# EAGLE board imix (EAGLE 7.5.0), part 1 of 2
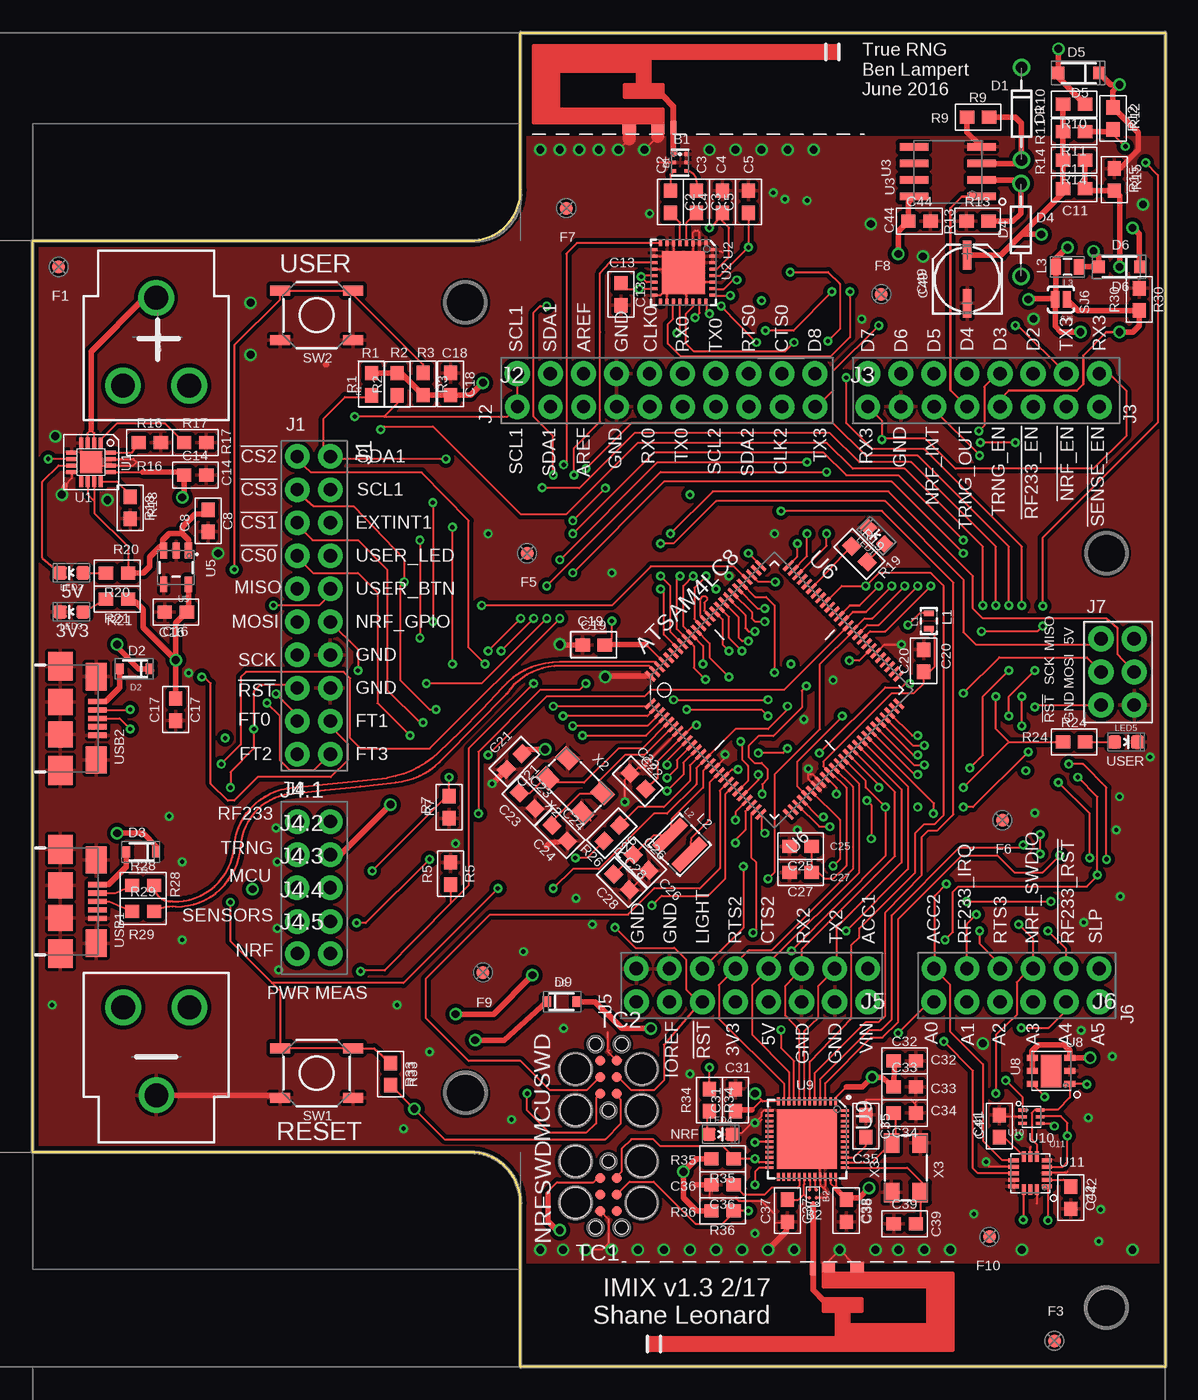
[diagram p8: board, top side]
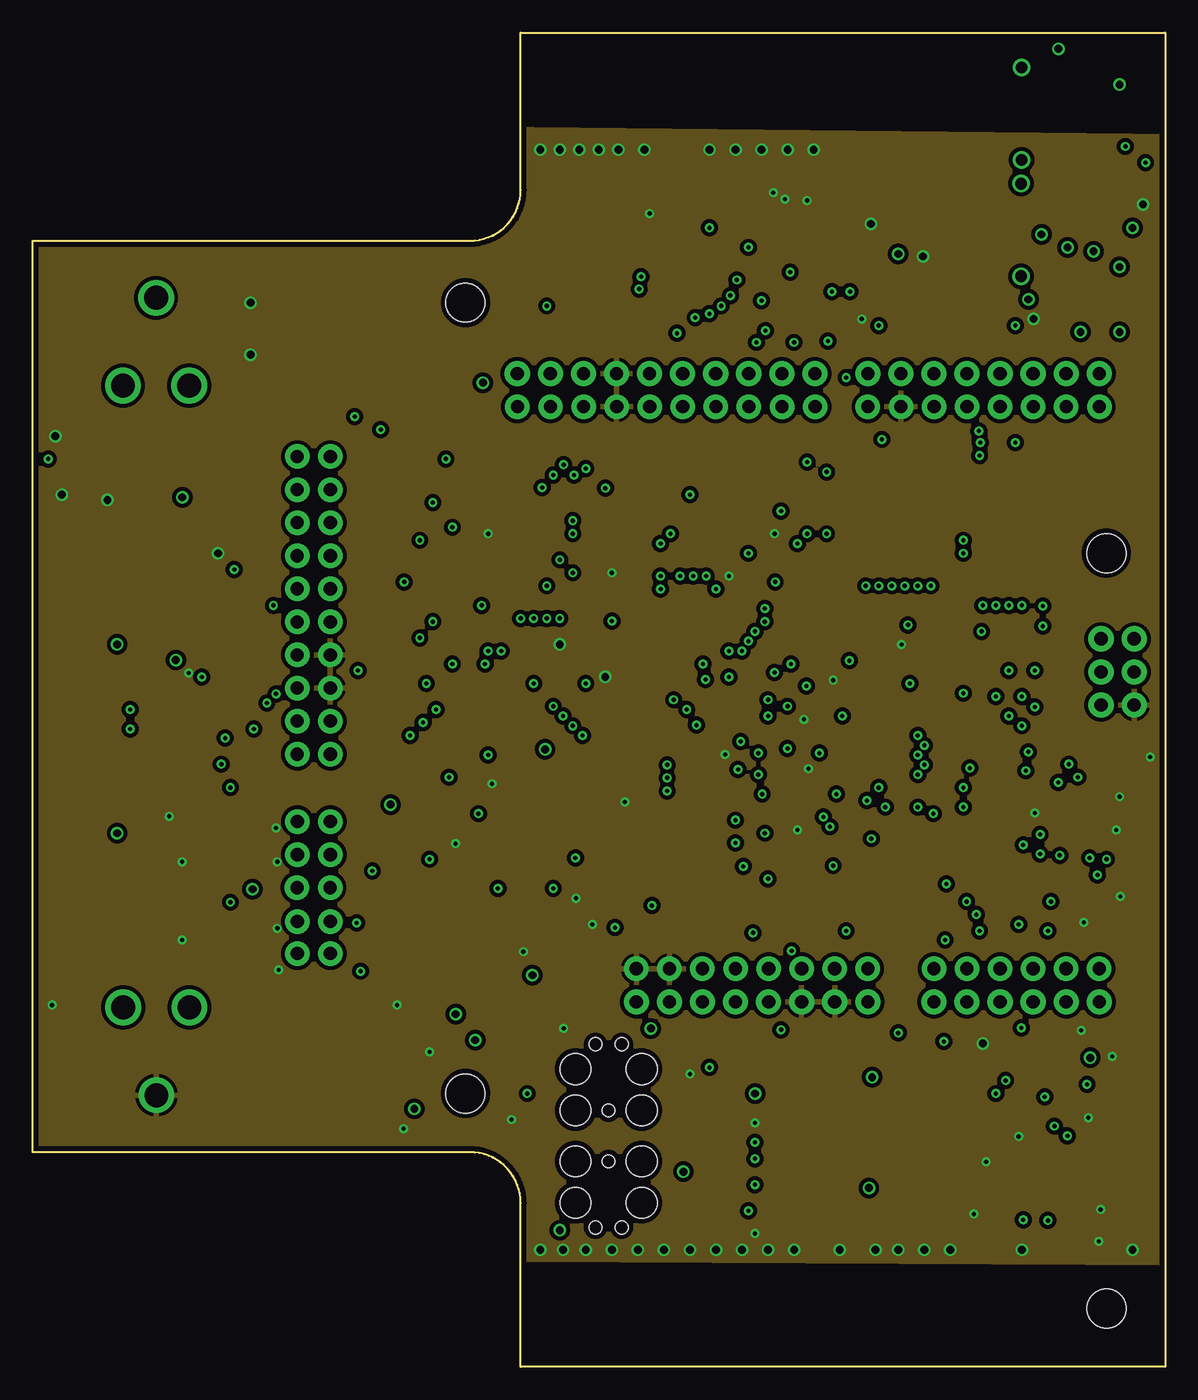
[diagram p9: board, inner layer Route2]
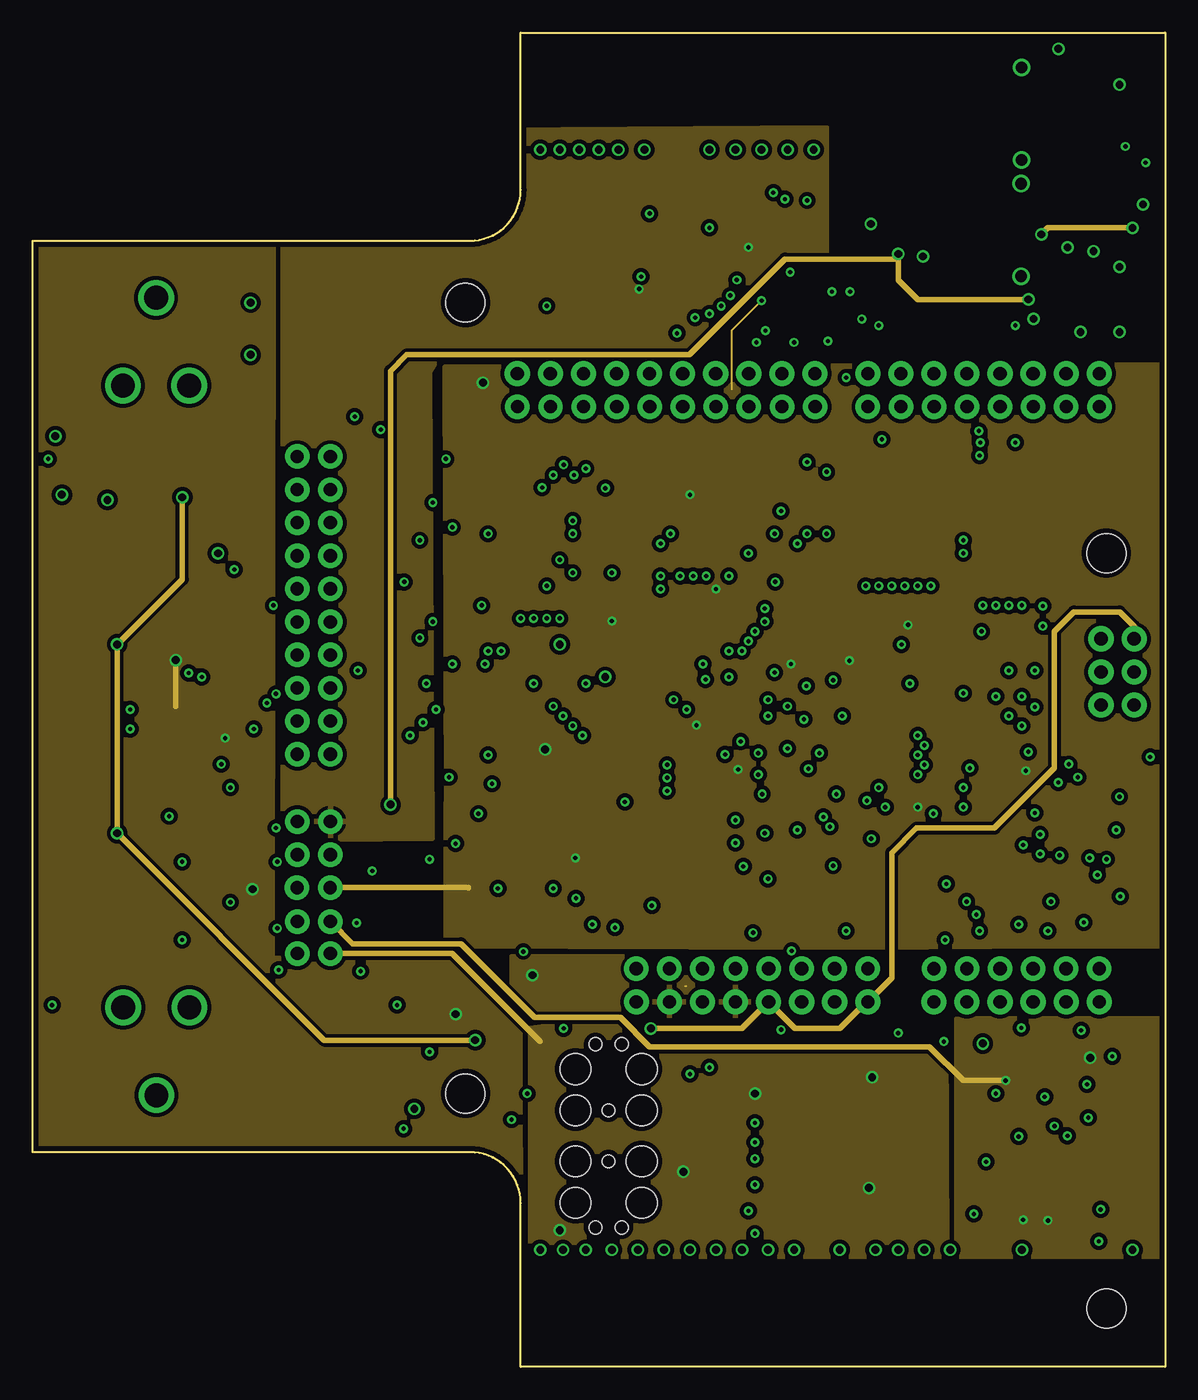
[diagram p10: board, inner layer Route15]
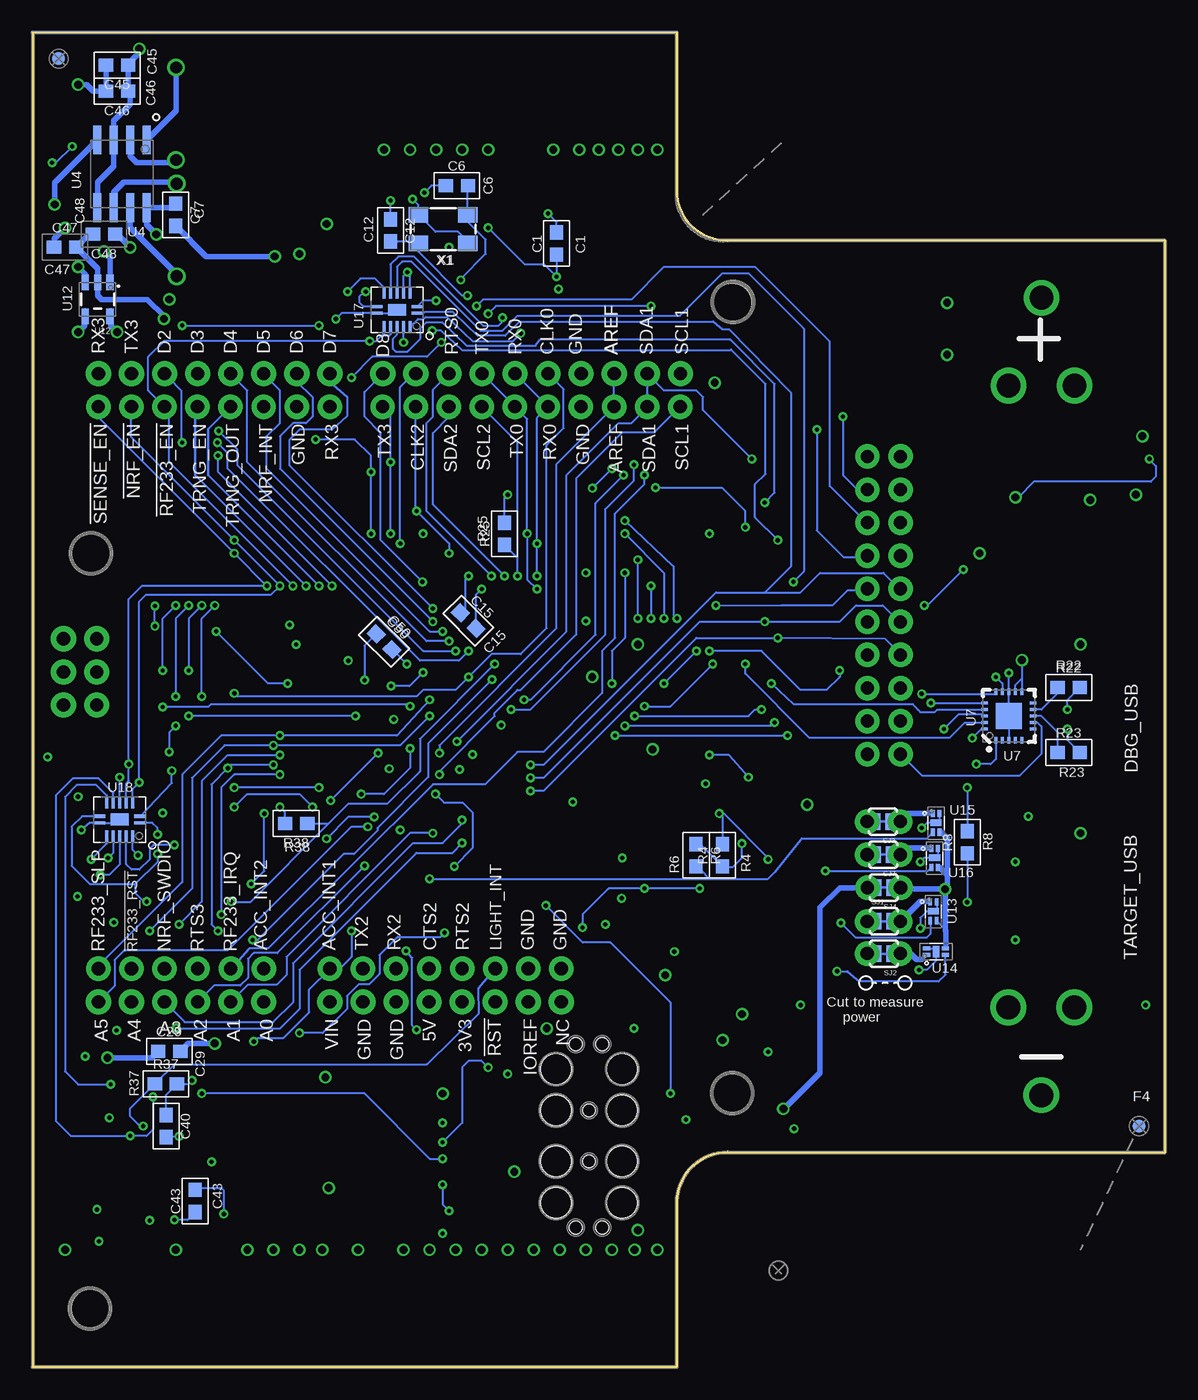
[diagram p11: board, bottom side, seen from below]

Size 87 x 102.5 mm. Coordinates in mm from the lower left corner, seen from the top.
Outline: 0,16.5 0,86.5 33.59,86.5 arc90 37.5,90.41 37.5,102.5 87,102.5 87,0 37.5,0 37.5,12.6 arc90 33.59,16.5 0,16.5
Copper layers (1+2*15+16): Top 0.0356mm / dielectric 9mil / Route2 0.0356mm / dielectric 40mil / Route15 0.0356mm / dielectric 9mil / Bottom 0.0356mm
Design rules "oshpark-2layer *": minimum track width 6mil, minimum drill 13mil, track to track 6mil, track to pad 6mil, pad to pad 6mil, via to via 6mil, smd to smd 6mil, copper to edge 15mil, drill to drill 6mil, minimum pad ring 7mil, minimum via ring 7mil, stop-mask expansion 2.5mil, vias tented up to drill 13mil, thermal gap 10mil
Net classes: 0 default: width 0.152 mm, drill 0.33 mm, clearance 0.152 mm; 1 power: width 0.152 mm, drill 0.33 mm, clearance 0.254 mm; 2 50ohm: width 0.152 mm, drill 0.33 mm, clearance 0.254 mm
Holes 3 mm at 33.25,81.75 33.25,21 82.5,4.5 82.5,62.5

## Footprints (pad centres in the part's own frame; a part is rotated, then mirrored left to right if it is on the bottom)
BALUN0805 = smd 0.3 x 0.3: 1 1.65,1.1; 2 1,1.1; 3 0.35,1.1; 4 0.35,0.15; 5 1,0.15; 6 1.65,0.15
BAL_NRF01D3 = smd 0.264 x 0.264: DIFF@1 0.219,0.25; DIFF@2 0.219,0.75; GND 0.819,0.75; SE 1.252,0.5; VCC 0.819,0.25
BATTERY_18650-HOLDER = drill 1.829: GND@1 30.628,0.01; GND@2 23.88,2.55; GND@3 23.88,-2.53; PWR@1 -30.628,-0.01; PWR@2 -23.88,2.53; PWR@3 -23.88,-2.55
C0603 = smd 1.1 x 1: 1 -0.85,0; 2 0.85,0
C0603-NOSILK = smd 1.1 x 1: 1 -0.85,0; 2 0.85,0
PANASONIC_C = smd 2.2 x 0.65: + 1.9,-0.2; - -1.8,-0.2
DIODE-ZENER = drill 0.9: P$1 -3.556,0; P$2 3.556,0
SOD-323 = smd 0.63 x 0.83: A 1.15,0; C -1.15,0
SOD-123 = smd 0.9 x 0.95: A 1.575,0; C -1.575,0
FIDUCIAL = smd 1 x 1: P$1 0,0
2X10_ROUND_NOSILK = drill 1.016 pad 1.88: 1 -11.43,-1.27; 2 -11.43,1.27; 3 -8.89,-1.27; 4 -8.89,1.27; 5 -6.35,-1.27; 6 -6.35,1.27; 7 -3.81,-1.27; 8 -3.81,1.27; 9 -1.27,-1.27; 10 -1.27,1.27; 11 1.27,-1.27; 12 1.27,1.27; 13 3.81,-1.27; 14 3.81,1.27; 15 6.35,-1.27; 16 6.35,1.27; 17 8.89,-1.27; 18 8.89,1.27; 19 11.43,-1.27; 20 11.43,1.27
1X10_NO_SILK = drill 1.016 pad 1.88: 1 0,0; 2 2.54,0; 3 5.08,0; 4 7.62,0; 5 10.16,0; 6 12.7,0; 7 15.24,0; 8 17.78,0; 9 20.32,0; 10 22.86,0
ARDUINO_R3_NO_HOLES = drill 1.016 pad 1.93: 3.3V 35.56,2.54; 5V 38.1,2.54; A0 50.8,2.54; A1 53.34,2.54; A2 55.88,2.54; A3 58.42,2.54; A4 60.96,2.54; A5 63.5,2.54; AREF 23.876,50.8; D0 63.5,50.8; D1 60.96,50.8; D2 58.42,50.8; D3 55.88,50.8; D4 53.34,50.8; D5 50.8,50.8; D6 48.26,50.8; D7 45.72,50.8; D8 41.656,50.8; D9 39.116,50.8; D10 36.576,50.8; D11 34.036,50.8; D12 31.496,50.8; D13 28.956,50.8; GND@1 40.64,2.54; GND@2 43.18,2.54; GND@3 26.416,50.8; GND@4 66.18,25.35; IOREF 30.48,2.54; MISO 63.64,30.43; MOSI 66.18,27.89; NC 27.94,2.54; RESET@1 33.02,2.54; RESET@2 63.64,25.35; SCK 63.64,27.89; SCL 18.796,50.8; SDA 21.336,50.8; VCC 66.18,30.43; VIN 45.72,2.54
1X08_NO_SILK = drill 1.016 pad 1.88: 1 0,0; 2 2.54,0; 3 5.08,0; 4 7.62,0; 5 10.16,0; 6 12.7,0; 7 15.24,0; 8 17.78,0
1X02_NO_SILK = drill 1.016 pad 1.88: 1 0,0; 2 2.54,0
1X06_NO_SILK = drill 1.016 pad 1.88: 1 0,0; 2 2.54,0; 3 5.08,0; 4 7.62,0; 5 10.16,0; 6 12.7,0
L0603 = smd 0.4 x 0.8: 1 0.2,0.4; 2 1.4,0.4
L1212 = smd 0.9 x 3: 1 -1.05,0; 2 1.05,0
0805 = smd 0.8 x 1.2: 1 -0.9,0; 2 0.9,0
LED-0603 = smd 1 x 1: A 0,-0.877; C 0,0.877
0603-RES = smd 1.1 x 1: 1 -0.85,0; 2 0.85,0
PAD-JUMPER-2-NC_BY_TRACE_YES_SILK = smd 0.635 x 1.27: 1 -0.508,0; 2 0.508,0
SJ_2S-NO = smd 0.635 x 1.27: 1 -0.45,0; 2 0.45,0
TACTILE-SWITCH-SMD = smd 1.524 x 0.762: 1 -2.794,1.905; 2 2.794,1.905; 3 -2.794,-1.905; 4 2.794,-1.905
TC2030-IDC = smd 0.787 x 0.787: 1 -1.27,-0.635; 2 -1.27,0.635; 3 0,-0.635; 4 0,0.635; 5 1.27,-0.635; 6 1.27,0.635 | hole 0.991: -2.54,0; 2.54,1.016; 2.54,-1.016 | hole 2.375: -2.54,2.54; -2.54,-2.54; 0.635,2.54; 0.635,-2.54
QFP16_3X3 = smd 0.85 x 0.3: 1 -1.475,0.75; 2 -1.475,0.25; 3 -1.475,-0.25; 4 -1.475,-0.75; 9 1.475,-0.75; 10 1.475,-0.25; 11 1.475,0.25; 12 1.475,0.75 | smd 0.3 x 0.85: 5 -0.75,-1.475; 6 -0.25,-1.475; 7 0.25,-1.475; 8 0.75,-1.475; 13 0.75,1.475; 14 0.25,1.475; 15 -0.25,1.475; 16 -0.75,1.475 | smd 1.7 x 1.7: PAD 0,0
32QN2 = smd 0.5 x 0.23: 1 -2.25,1.75; 2 -2.25,1.25; 3 -2.25,0.75; 4 -2.25,0.25; 5 -2.25,-0.25; 6 -2.25,-0.75; 7 -2.25,-1.25; 8 -2.25,-1.75; 17 2.25,-1.75; 18 2.25,-1.25; 19 2.25,-0.75; 20 2.25,-0.25; 21 2.25,0.25; 22 2.25,0.75; 23 2.25,1.25; 24 2.25,1.75 | smd 0.23 x 0.5: 9 -1.75,-2.25; 10 -1.25,-2.25; 11 -0.75,-2.25; 12 -0.25,-2.25; 13 0.25,-2.25; 14 0.75,-2.25; 15 1.25,-2.25; 16 1.75,-2.25; 25 1.75,2.25; 26 1.25,2.25; 27 0.75,2.25; 28 0.25,2.25; 29 -0.25,2.25; 30 -0.75,2.25; 31 -1.25,2.25; 32 -1.75,2.25 | smd 3.3 x 3.3: PADDLE 0,0
SO8 = smd 0.6 x 2.2: 1 -1.905,-2.6; 2 -0.635,-2.6; 3 0.635,-2.6; 4 1.905,-2.6; 5 1.905,2.6; 6 0.635,2.6; 7 -0.635,2.6; 8 -1.905,2.6
SOT23-5 = smd 0.55 x 1.2: 1 -0.95,-1.3; 2 0,-1.3; 3 0.95,-1.3; 4 0.95,1.3; 5 -0.95,1.3
TQFP100 = smd 1 x 0.25: 1 -7.5,6; 2 -7.5,5.5; 3 -7.5,5; 4 -7.5,4.5; 5 -7.5,4; 6 -7.5,3.5; 7 -7.5,3; 8 -7.5,2.5; 9 -7.5,2; 10 -7.5,1.5; 11 -7.5,1; 12 -7.5,0.5; 13 -7.5,0; 14 -7.5,-0.5; 15 -7.5,-1; 16 -7.5,-1.5; 17 -7.5,-2; 18 -7.5,-2.5; 19 -7.5,-3; 20 -7.5,-3.5; 21 -7.5,-4; 22 -7.5,-4.5; 23 -7.5,-5; 24 -7.5,-5.5; 25 -7.5,-6; 51 7.5,-6; 52 7.5,-5.5; 53 7.5,-5; 54 7.5,-4.5; 55 7.5,-4; 56 7.5,-3.5; 57 7.5,-3; 58 7.5,-2.5; 59 7.5,-2; 60 7.5,-1.5; 61 7.5,-1; 62 7.5,-0.5; 63 7.5,0; 64 7.5,0.5; 65 7.5,1; 66 7.5,1.5; 67 7.5,2; 68 7.5,2.5; 69 7.5,3; 70 7.5,3.5; 71 7.5,4; 72 7.5,4.5; 73 7.5,5; 74 7.5,5.5; 75 7.5,6 | smd 0.25 x 1: 26 -6,-7.5; 27 -5.5,-7.5; 28 -5,-7.5; 29 -4.5,-7.5; 30 -4,-7.5; 31 -3.5,-7.5; 32 -3,-7.5; 33 -2.5,-7.5; 34 -2,-7.5; 35 -1.5,-7.5; 36 -1,-7.5; 37 -0.5,-7.5; 38 0,-7.5; 39 0.5,-7.5; 40 1,-7.5; 41 1.5,-7.5; 42 2,-7.5; 43 2.5,-7.5; 44 3,-7.5; 45 3.5,-7.5; 46 4,-7.5; 47 4.5,-7.5; 48 5,-7.5; 49 5.5,-7.5; 50 6,-7.5; 76 6,7.5; 77 5.5,7.5; 78 5,7.5; 79 4.5,7.5; 80 4,7.5; 81 3.5,7.5; 82 3,7.5; 83 2.5,7.5; 84 2,7.5; 85 1.5,7.5; 86 1,7.5; 87 0.5,7.5; 88 0,7.5; 89 -0.5,7.5; 90 -1,7.5; 91 -1.5,7.5; 92 -2,7.5; 93 -2.5,7.5; 94 -3,7.5; 95 -3.5,7.5; 96 -4,7.5; 97 -4.5,7.5; 98 -5,7.5; 99 -5.5,7.5; 100 -6,7.5
QFN20 = smd 0.5 x 0.25: 1 -1.85,1; 2 -1.85,0.5; 3 -1.85,0; 4 -1.85,-0.5; 5 -1.85,-1; 11 1.85,-1; 12 1.85,-0.5; 13 1.85,0; 14 1.85,0.5; 15 1.85,1 | smd 0.25 x 0.5: 6 -1,-1.85; 7 -0.5,-1.85; 8 0,-1.85; 9 0.5,-1.85; 10 1,-1.85; 16 1,1.85; 17 0.5,1.85; 18 0,1.85; 19 -0.5,1.85; 20 -1,1.85 | smd 2 x 2: PADDLE 0,0
SI7021 = smd 0.85 x 0.45: 1 -1.45,1; 2 -1.45,0; 3 -1.45,-1; 4 1.45,-1; 5 1.45,0; 6 1.45,1 | smd 1.6 x 2.5: P$7 0,0
QFN48_6X6 = smd 0.6 x 0.2: 1 -2.9,2.2; 2 -2.9,1.8; 3 -2.9,1.4; 4 -2.9,1; 5 -2.9,0.6; 6 -2.9,0.2; 7 -2.9,-0.2; 8 -2.9,-0.6; 9 -2.9,-1; 10 -2.9,-1.4; 11 -2.9,-1.8; 12 -2.9,-2.2; 25 2.9,-2.2; 26 2.9,-1.8; 27 2.9,-1.4; 28 2.9,-1; 29 2.9,-0.6; 30 2.9,-0.2; 31 2.9,0.2; 32 2.9,0.6; 33 2.9,1; 34 2.9,1.4; 35 2.9,1.8; 36 2.9,2.2 | smd 0.2 x 0.6: 13 -2.2,-2.9; 14 -1.8,-2.9; 15 -1.4,-2.9; 16 -1,-2.9; 17 -0.6,-2.9; 18 -0.2,-2.9; 19 0.2,-2.9; 20 0.6,-2.9; 21 1,-2.9; 22 1.4,-2.9; 23 1.8,-2.9; 24 2.2,-2.9; 37 2.2,2.9; 38 1.8,2.9; 39 1.4,2.9; 40 1,2.9; 41 0.6,2.9; 42 0.2,2.9; 43 -0.2,2.9; 44 -0.6,2.9; 45 -1,2.9; 46 -1.4,2.9; 47 -1.8,2.9; 48 -2.2,2.9 | smd 4.6 x 4.6: PADDLE 0,0
ISL29035 = smd 0.65 x 0.25: 1 -0.675,0.5; 2 -0.675,0; 3 -0.675,-0.5; 4 0.675,-0.5; 5 0.675,0; 6 0.675,0.5
QFN16_3,5 = smd 0.8 x 0.3: 1 -1.275,1; 2 -1.275,0.5; 3 -1.275,0; 4 -1.275,-0.5; 5 -1.275,-1; 9 1.275,-1; 10 1.275,-0.5; 11 1.275,0; 12 1.275,0.5; 13 1.275,1 | smd 0.3 x 0.8: 6 -0.5,-1.275; 7 0,-1.275; 8 0.5,-1.275; 14 0.5,1.275; 15 0,1.275; 16 -0.5,1.275
TDFN4 = smd 0.3 x 0.55: 1 0.25,-0.725; 2 -0.25,-0.725; 3 -0.25,0.725; 4 0.25,0.725 | smd 0.86 x 0.5: PADDLE 0,0
DHVQFN14 = smd 0.9 x 0.24: 1 -1.55,0.25; 7 1.55,0.25; 8 1.55,-0.25; 14 -1.55,-0.25 | smd 0.24 x 0.9: 2 -1,1.3; 3 -0.5,1.3; 4 0,1.3; 5 0.5,1.3; 6 1,1.3; 9 1,-1.3; 10 0.5,-1.3; 11 0,-1.3; 12 -0.5,-1.3; 13 -1,-1.3 | smd 1.4 x 0.9: PADDLE 0,0
DN007-2 = smd 0.46 x 1: FEED 2.22,-2.8 | smd 1.01 x 0.74: GND -1.16,-2.93; GND@1 1.035,-2.93
USB-AB-MICRO-SMD = smd 1.4 x 0.4: D+ 2.85,0; D- 2.85,0.65; GND 2.85,-1.3; ID 2.85,-0.65; VBUS 2.85,1.3 | smd 1.9 x 2.2: SHIELD1 0,4; SHIELD4 0,-4 | smd 1.9 x 2: SHIELD2 0,1.25; SHIELD3 0,-1.25 | smd 1.6 x 2.1: SHIELD5 2.75,3.2; SHIELD6 2.75,-3.2
CTS_405_SERIES = smd 1.5 x 1.2: 1 -1.9,-1.1; 3 1.9,1.1; CASE@2 -1.9,1.1; CASE@4 1.9,-1.1

## Placement (x,y rotation side)
B1  2450BM15A0015  [BALUN0805]  50.37,91.52 90 top
B2  BAL_NRF01D3  [BAL_NRF01D3]  59.45,13.82 270 top
BAT1  [BATTERY_18650-HOLDER]  9.5,51.5 270 top
C1  100nF  [C0603]  46.73,86.29 90 bottom
C2  22pF  [C0603]  49,89.5 270 top
C3  22pF  [C0603]  51,89.5 270 top
C4  100nF  [C0603]  53,89.5 90 top
C5  1uF  [C0603]  55,89.5 90 top
C6  13pF  [C0603]  54.4,90.75 0 bottom
C7  0.47uF  [C0603]  76,88.5 270 bottom
C8  4.7uF  [C0603]  13.5,65 270 top
C11  22pF  [C0603]  80,90.5 0 top
C12  13pF  [C0603]  59.5,87.3 270 bottom
C13  1uF  [C0603]  45.2,82.4 270 top
C14  1uF  [C0603]  12.5,68.5 0 top
C15  100nF  [C0603]  53.53,57.33 315 bottom
C16  1uF  [C0603]  11,58 180 top
C17  100nF  [C0603]  11,50.5 270 top
C18  10uF  [C0603]  32.1,75.5 270 top
C19  100nF  [C0603]  43.1,55.47 0 top
C20  100nF  [C0603]  68.45,54.25 90 top
C21  100nF  [C0603]  37,46.5 225 top
C22  100nF  [C0603]  46.5,45 315 top
C23  13pF  [C0603]  38,43.5 315 top
C24  13pF  [C0603]  40.5,41 315 top
C25  4.7uF  [C0603]  59,40 180 top
C26  6.8uF  [C0603]  46.75,38.75 315 top
C27  100nF  [C0603]  59,38 180 top
C28  100nF  [C0603]  45.25,37.25 315 top
C29  100nF  [C0603]  76.5,24.25 0 bottom
C31  100 nF  [C0603]  54,20.5 90 top
C32  100 nF  [C0603]  67,23.5 0 top
C33  100nF  [C0603]  67,21.5 0 top
C34  13pF  [C0603]  67,19.5 180 top
C35  1 nF  [C0603]  64,18.5 270 top
C36  47 nF  [C0603]  53,14 180 top
C37  2.2 nF  [C0603]  58,12 270 top
C38  1 nF  [C0603]  62.5,12 270 top
C39  13pF  [C0603]  67,11 0 top
C40  100nF  [C0603]  76.75,18.5 270 bottom
C41  100nF  [C0603]  74.25,18.5 90 top
C42  100nF  [C0603]  79.75,13 270 top
C43  100nF  [C0603]  74.5,12.75 90 bottom
C44  0.47uF  [C0603]  68.12,88.01 0 top
C45  DNP  [C0603]  80.5,100 180 bottom
C46  0.47uF  [C0603]  80.5,98 180 bottom
C47  0.47uF  [C0603-NOSILK]  84.5,86 0 bottom
C48  4.7uF  [C0603-NOSILK]  81.5,87 180 bottom
C49  10uF  [PANASONIC_C]  71.6,83.5 90 top
C50  100nF  [C0603]  59.99,55.71 315 bottom
D1  DIODE-ZENERPTH  [DIODE-ZENER]  75.97,96.27 270 top
D2  250mA/100V  [SOD-323]  7.86,53.63 180 top
D3  250mA/100V  [SOD-323]  8.36,39.56 180 top
D4  DIODE-ZENERPTH  [DIODE-ZENER]  75.93,87.34 90 top
D5  MBR0530  [SOD-123]  80.36,99.39 180 top
D6  MBR0530  [SOD-123]  83.5,84.5 180 top
D9  250mA/100V  [SOD-323]  40.65,28.06 0 top
F1  FIDUCIAL  [FIDUCIAL]  2,84.5 0 top
F2  FIDUCIAL  [FIDUCIAL]  85,100.5 0 bottom
F3  FIDUCIAL  [FIDUCIAL]  78.5,2 0 top
F4  FIDUCIAL  [FIDUCIAL]  2,18.5 0 bottom
F5  FIDUCIAL  [FIDUCIAL]  38,62.5 0 top
F6  FIDUCIAL  [FIDUCIAL]  74.5,42 0 top
F7  FIDUCIAL  [FIDUCIAL]  41,89 0 top
F8  FIDUCIAL  [FIDUCIAL]  65.2,82.4 0 top
F9  FIDUCIAL  [FIDUCIAL]  34.6,30.3 0 top
F10  FIDUCIAL  [FIDUCIAL]  73.5,10 0 top
J1  [2X10_ROUND_NOSILK]  21.6,58.5 270 top
J2  [1X10_NO_SILK]  37.25,73.76 0 top
J2_3_5_AND_6  ARDUINO_R3NO_HOLES  [ARDUINO_R3_NO_HOLES]  18.44,25.5 0 top
J3  [1X08_NO_SILK]  64.17,73.76 0 top
J4.1  [1X02_NO_SILK]  20.34,41.9 0 top
J4.2  [1X02_NO_SILK]  20.34,39.34 0 top
J4.3  [1X02_NO_SILK]  20.32,36.82 0 top
J4.4  [1X02_NO_SILK]  20.34,34.22 0 top
J4.5  [1X02_NO_SILK]  20.34,31.76 0 top
J5  [1X08_NO_SILK]  64.16,30.59 180 top
J6  [1X06_NO_SILK]  81.94,30.59 180 top
L1  BLM18HE152SN1  [L0603]  69.25,56.5 90 top
L2  22uH LQH3NPN220MJ0  [L1212]  49.72,40.11 315 top
L3  10uH  [0805]  79.5,84.5 180 top
LED1  [LED-0603]  64.82,63.84 45 top
LED2  [LED-0603]  3,61 90 top
LED3  [LED-0603]  3,58 90 top
LED4  [LED-0603]  52.85,17.88 270 top
LED5  [LED-0603]  84,48 270 top
R1  4.7K  [0603-RES]  26.03,75.49 90 top
R2  4.7K  [0603-RES]  27.99,75.49 90 top
R3  100K  [0603-RES]  30,75.5 270 top
R4  10K  [0603-RES]  34,39.3 90 bottom
R5  10K  [0603-RES]  32.1,37.9 270 top
R6  10K  [0603-RES]  36.02,39.3 270 bottom
R7  10K  [0603-RES]  32,43 90 top
R8  1K  [0603-RES]  15.2,40.3 90 bottom
R9  10K  [0603-RES]  72.63,96 0 top
R10  10K  [0603-RES]  80,97 180 top
R11  DNP  [0603-RES]  80,94.9 180 top
R12  DNP  [0603-RES]  83,95.9 270 top
R13  10K  [0603-RES]  72.6,88 0 top
R14  2.2M  [0603-RES]  80,92.7 180 top
R15  160K  [0603-RES]  83.1,91.2 270 top
R16  10K  [0603-RES]  9,71 0 top
R17  10K  [0603-RES]  12.5,71 0 top
R18  DNP  [0603-RES]  7.5,66 270 top
R19  1K  [0603-RES]  63.52,62.44 315 top
R20  1K  [0603-RES]  6.5,61 180 top
R21  1K  [0603-RES]  6.5,59 180 top
R22  27  [0603-RES]  7.4,52.2 0 bottom
R23  27  [0603-RES]  7.4,47.2 0 bottom
R24  1K  [0603-RES]  80,48 0 top
R25  4.7K  [0603-RES]  50.75,64 90 bottom
R26  10K  [0603-RES]  44.5,41 225 top
R28  27  [0603-RES]  8.5,37 0 top
R29  27  [0603-RES]  8.5,35 0 top
R30  10K  [0603-RES]  85,82 270 top
R33  100K  [0603-RES]  27.5,22.5 270 top
R34  1K  [0603-RES]  52,20.5 270 top
R35  10K  [0603-RES]  53,16 180 top
R36  10K  [0603-RES]  53,12 180 top
R37  4.7K  [0603-RES]  76.75,21.75 0 bottom
R38  4.7K  [0603-RES]  66.75,41.75 180 bottom
SJ1  [PAD-JUMPER-2-NC_BY_TRACE_YES_SILK]  21.6,34.24 0 bottom
SJ2  [PAD-JUMPER-2-NC_BY_TRACE_YES_SILK]  21.59,31.74 180 bottom
SJ3  [PAD-JUMPER-2-NC_BY_TRACE_YES_SILK]  21.68,41.89 180 bottom
SJ4  [PAD-JUMPER-2-NC_BY_TRACE_YES_SILK]  21.61,36.82 180 bottom
SJ6  SOLDERJUMPERNO  [SJ_2S-NO]  79,82 180 top
SJ7  [PAD-JUMPER-2-NC_BY_TRACE_YES_SILK]  21.65,39.35 180 bottom
SW1  TAC_SWITCHSMD  [TACTILE-SWITCH-SMD]  21.82,22.57 180 top
SW2  TAC_SWITCHSMD  [TACTILE-SWITCH-SMD]  21.82,80.78 180 top
TC1  TC2030-IDC  [TC2030-IDC]  44.25,13.25 270 top
TC2  TC2030-IDC  [TC2030-IDC]  44.25,22.25 90 top
U1  BQ2423X  [QFP16_3X3]  4.5,69.5 270 top
U2  [32QN2]  50,84.07 270 top
U3  TLV3202  [SO8]  70.31,91.81 90 top
U4  LM358  [SO8]  80.14,91.64 180 bottom
U5  LDO-TPS78233  [SOT23-5]  11.03,61.41 180 top
U6  ATSAM4LCX_100  [TQFP100]  57,52 45 top
U7  [QFN20]  12,50 90 bottom
U8  SI7021  [SI7021]  78.25,22.73 180 top
U9  NRF51422  [QFN48_6X6]  59.5,17.5 270 top
U10  ISL29035  [ISL29035]  76.73,19.22 0 top
U11  FX0S8700CQ  [QFN16_3,5]  76.64,14.88 180 top
U12  296-12686-1-ND  [SOT23-5]  82,82 180 bottom
U13  SIP32401A  [TDFN4]  17.8,35 180 bottom
U14  SIP32401A  [TDFN4]  17.6,31.9 270 bottom
U15  SIP32401A  [TDFN4]  17.6,41.8 180 bottom
U16  SIP32401A  [TDFN4]  17.7,39.1 180 bottom
U17  74LVC4066BQ  [DHVQFN14]  59,81.2 180 bottom
U18  74LVC4066BQ  [DHVQFN14]  80.3,42.05 180 bottom
U$1  INVERTED_F_ANTENNA-2  [DN007-2]  47,98 0 top
U$4  INVERTED_F_ANTENNA-2  [DN007-2]  62.18,4.76 180 top
USB1  [USB-AB-MICRO-SMD]  2.14,35.75 0 top
USB2  [USB-AB-MICRO-SMD]  2.14,49.82 0 top
X1  16MHz  [CTS_405_SERIES]  55.45,87.4 180 bottom
X2  16MHz  [CTS_405_SERIES]  41.66,44.64 135 top
X3  16MHz  [CTS_405_SERIES]  67.09,15.3 90 top